# EAGLE schematic Magazine Reloader (EAGLE 7.6.0)
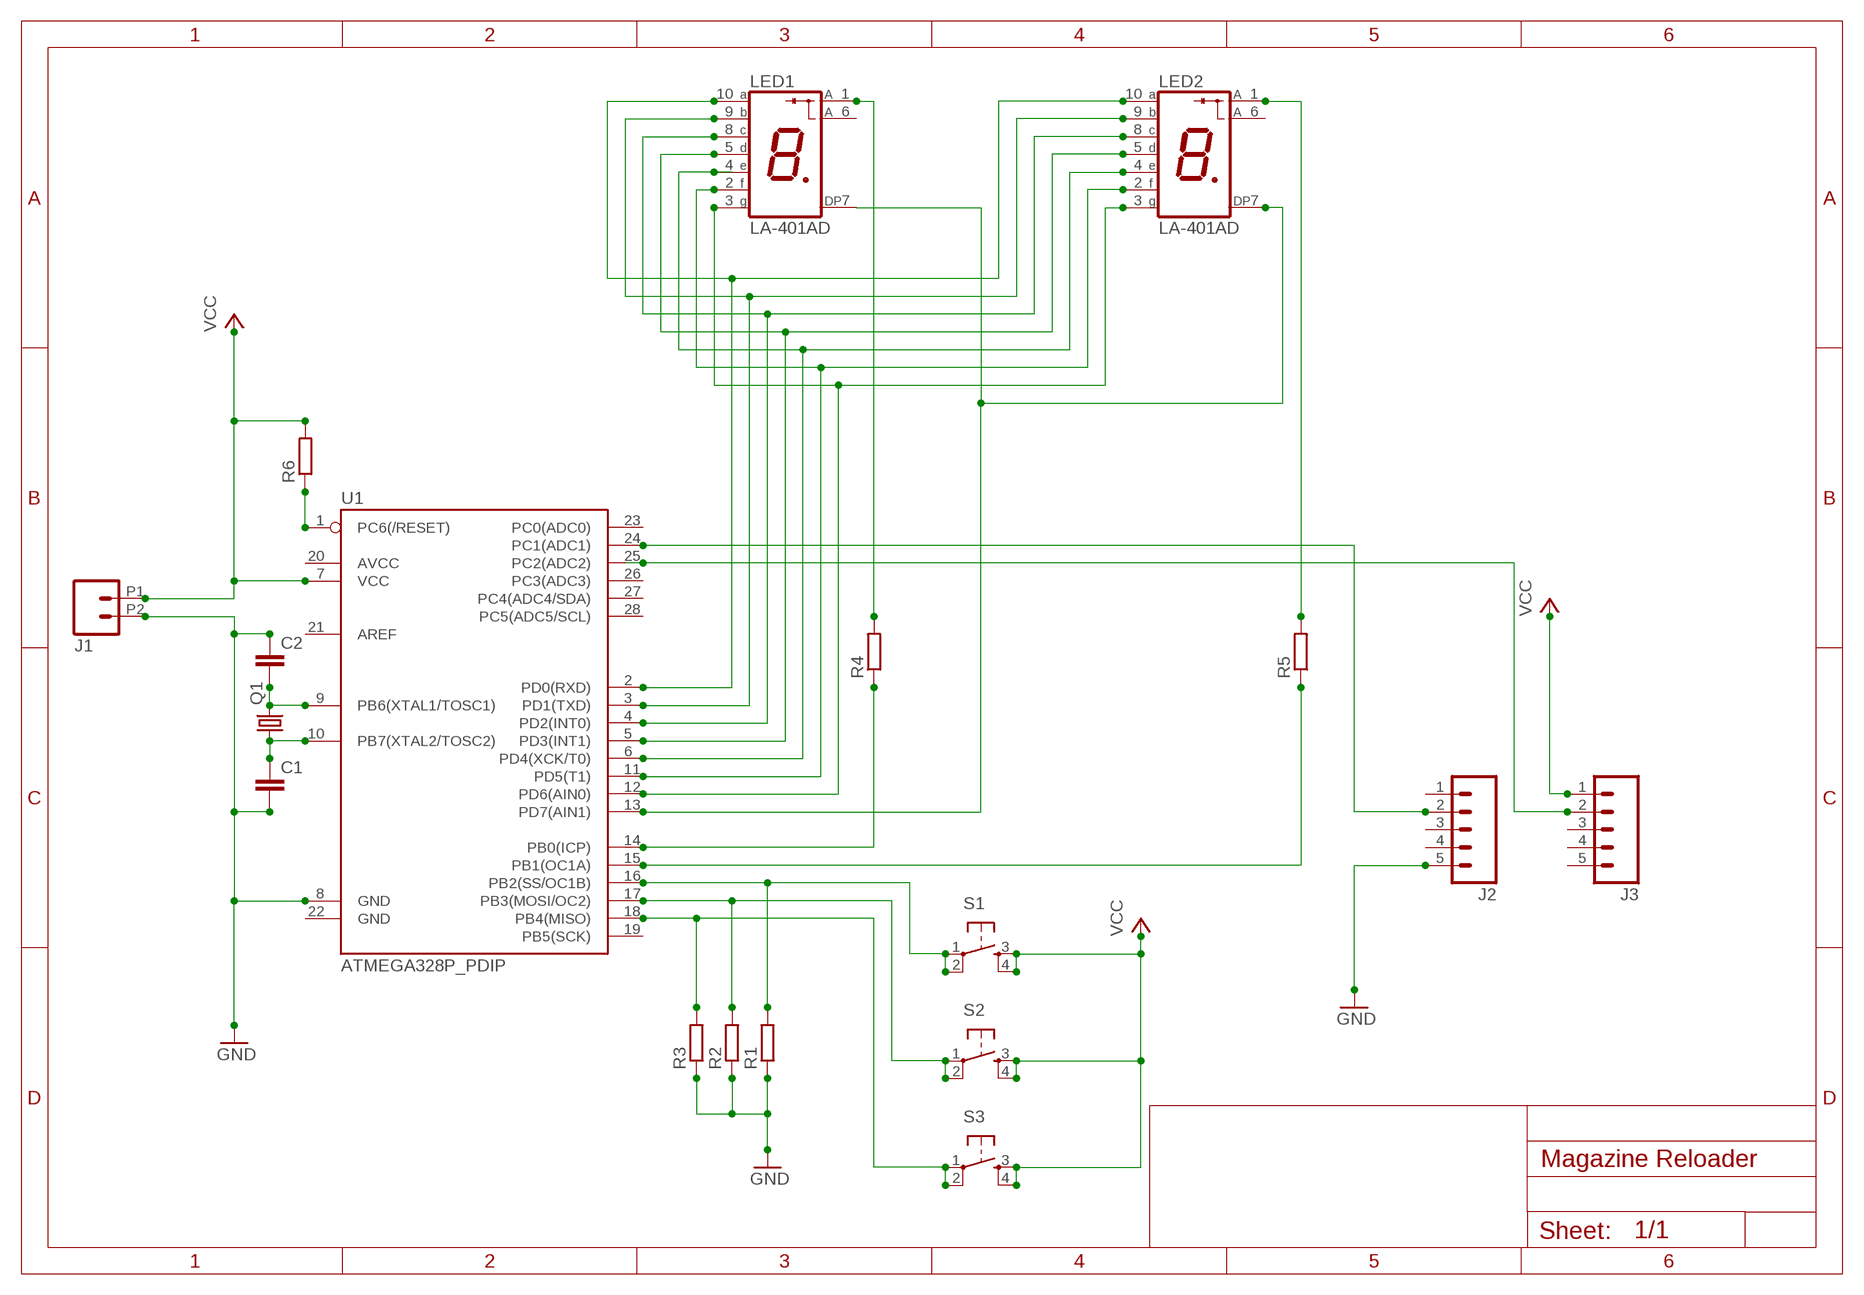
[diagram p0: schematic, sheet 1]

## Parts
C1  C-EU025-025X050  [C025-025X050]
C2  C-EU025-025X050  [C025-025X050]
J1  M022.54MM_SCREWTERM  [1X02_2.54_SCREWTERM]
J2  M05PTH_LONGPADS  [1X05_LONGPADS]
J3  M05PTH_LONGPADS  [1X05_LONGPADS]
LED1  LA-401AD  [LA-401]
LED2  LA-401AD  [LA-401]
Q1  CRYSTALHC49S  [HC49/S]
R1  R-EU_0207/7  [0207/7]
R2  R-EU_0207/7  [0207/7]
R3  R-EU_0207/7  [0207/7]
R4  R-EU_0207/7  [0207/7]
R5  R-EU_0207/7  [0207/7]
R6  R-EU_0207/7  [0207/7]
S1  TAC_SWITCHPTH  [TACTILE-PTH]
S2  TAC_SWITCHPTH  [TACTILE-PTH]
S3  TAC_SWITCHPTH  [TACTILE-PTH]
U1  ATMEGA328P_PDIP  [DIL28-3]

## Nets
GND: C1.2 C2.1 J1.P2 J2.5 R1.1 R2.1 R3.1 U1.8(GND)
N$1: LED1.3(G) LED2.3(G) U1.12(PD6(AIN0))
N$2: LED1.2(F) LED2.2(F) U1.11(PD5(T1))
N$3: LED1.4(E) LED2.4(E) U1.6(PD4(XCK/T0))
N$4: LED1.5(D) LED2.5(D) U1.5(PD3(INT1))
N$5: LED1.8(C) LED2.8(C) U1.4(PD2(INT0))
N$6: LED1.9(B) LED2.9(B) U1.3(PD1(TXD))
N$7: LED1.10(A) LED2.10(A) U1.2(PD0(RXD))
N$8: LED1.7(DP) LED2.7(DP) U1.13(PD7(AIN1))
N$9: R4.1 U1.14(PB0(ICP))
N$10: R5.1 U1.15(PB1(OC1A))
N$11: LED1.1(A) R4.2
N$12: LED2.1(A) R5.2
N$13: R3.2 S3.1 S3.2 U1.18(PB4(MISO))
N$14: R2.2 S2.1 S2.2 U1.17(PB3(MOSI/OC2))
N$15: R1.2 S1.1 S1.2 U1.16(PB2(SS/OC1B))
N$16: C2.2 Q1.2 U1.9(PB6(XTAL1/TOSC1))
N$17: C1.1 Q1.1 U1.10(PB7(XTAL2/TOSC2))
N$18: R6.1 U1.1(PC6(/RESET))
N$20: J2.2 U1.24(PC1(ADC1))
N$21: J3.2 U1.25(PC2(ADC2))
VCC: J1.P1 J3.1 R6.2 S1.3 S1.4 S2.3 S2.4 S3.3 S3.4 U1.7(VCC)
Unconnected: J2.1 J2.3 J2.4 J3.3 J3.4 J3.5 LED1.6(A) LED2.6(A) U1.19(PB5(SCK)) U1.20(AVCC) U1.21(AREF) U1.22(GND) U1.23(PC0(ADC0)) U1.26(PC3(ADC3)) U1.27(PC4(ADC4/SDA)) U1.28(PC5(ADC5/SCL))

## Library data of the parts
C1 C2 = resistor:C-EU: CAPACITOR, European symbol
J1 = SparkFun-Connectors:M02: Standard 2-pin 0.1" header. Use with - straight break away headers ( PRT-00116) - right angle break away headers (PRT-00553) - swiss pins (PRT-00743) - machine pins (PRT-00117) - female headers (PRT-00115) Molex polarized connector foot print use with: PRT-08233 with associated crimp pins and housings. 2.54_SCREWTERM for use with PRT-10571. 3.5mm Screw Terminal footprints for PRT-08084 5mm Screw Terminal footprints for use with PRT-08432
J2 J3 = SparkFun-Connectors:M05: Header 5 Standard 5-pin 0.1" header. Use with straight break away headers (SKU : PRT-00116), right angle break away headers (PRT-00553), swiss pins (PRT-00743), machine pins (PRT-00117), and female headers (PRT-00115). Molex polarized connector foot print use with SKU : PRT-08230 with associated crimp pins and housings.
LED1 LED2 = led-7-segment:LA-401*D: Single Digit LED Numeric Display (anode common) Source: ROHM .. la-1401dn.pdf; OC_FARNELL: unknown; OC_NEWARK: unknown
Q1 = crystal:CRYSTAL: CRYSTAL; OC_FARNELL: 1667008; OC_NEWARK: unknown
R1-R6 = resistor:R-EU_: RESISTOR, European symbol
S1-S3 = SparkFun-Retired:TAC_SWITCH: Momentary Switch Button commonly used for reset or general input. Spark Fun Electronics SKU : COM-00097 SMT- SWCH-08247
U1 = SparkFun-DigitalIC:ATMEGA328P_PDIP: uC used in the Arduino 32kb flash, 1k EEPROM, 2k SRAM This is the through-hole version of this chip.